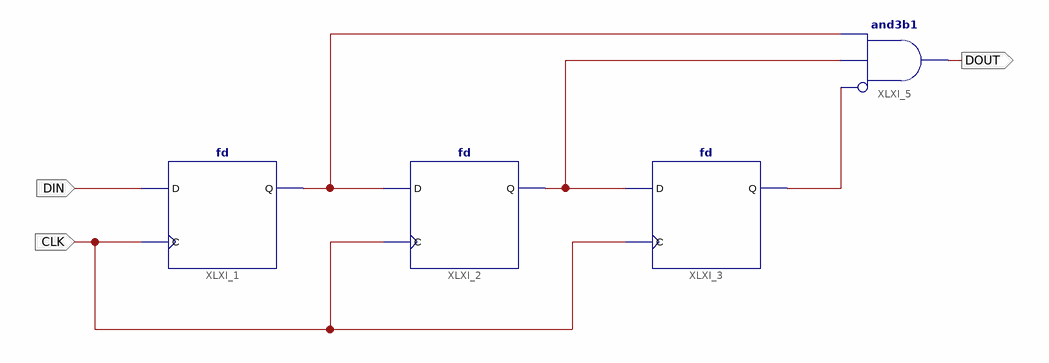
[diagram p0: schematic sheet 1]
// Xilinx ISE schematic debounce.sch (spartan3) as structural Verilog: 4 symbols, 3 ports
module debounce (
  input  DIN,
  input  CLK,
  output DOUT
);

  wire XLXN_7, XLXN_8, XLXN_9;

  fd XLXI_1 (.C(CLK), .D(DIN), .Q(XLXN_7));
  fd XLXI_2 (.C(CLK), .D(XLXN_7), .Q(XLXN_8));
  fd XLXI_3 (.C(CLK), .D(XLXN_8), .Q(XLXN_9));
  and XLXI_5 (DOUT, ~XLXN_9, XLXN_8, XLXN_7);  // and3b1
endmodule
